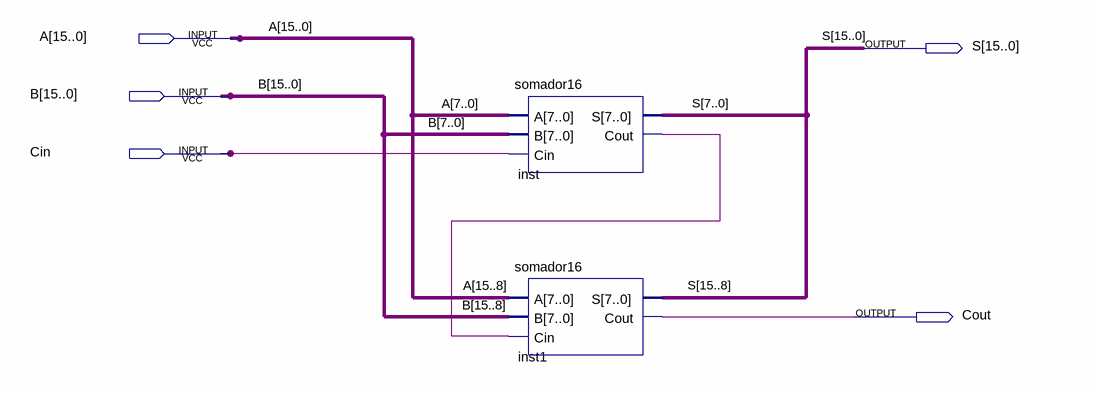
[diagram p0: schematic sheet]
// Quartus schematic somador32.bdf as structural Verilog: 2 symbols, 5 pins
module somador32 (
  input  [15:0] A,
  input  [15:0] B,
  input  Cin,
  output [15:0] S,
  output Cout
);

  wire inst_cout;

  somador16 inst (.A(A[7:0]), .B(B[7:0]), .Cin(Cin), .S(S[7:0]), .Cout(inst_cout));
  somador16 inst1 (.A(A[15:8]), .B(B[15:8]), .Cin(inst_cout), .S(S[15:8]), .Cout(Cout));
endmodule
